# Altium schematic sheet DDR.SchDoc: XC7A3G-LDDR3
size A4; Date: 9 AUG 2026; Engineer: Parsa Malekpour; Revision: 1.0.0; SheetNumber: 10; SheetTotal: 18
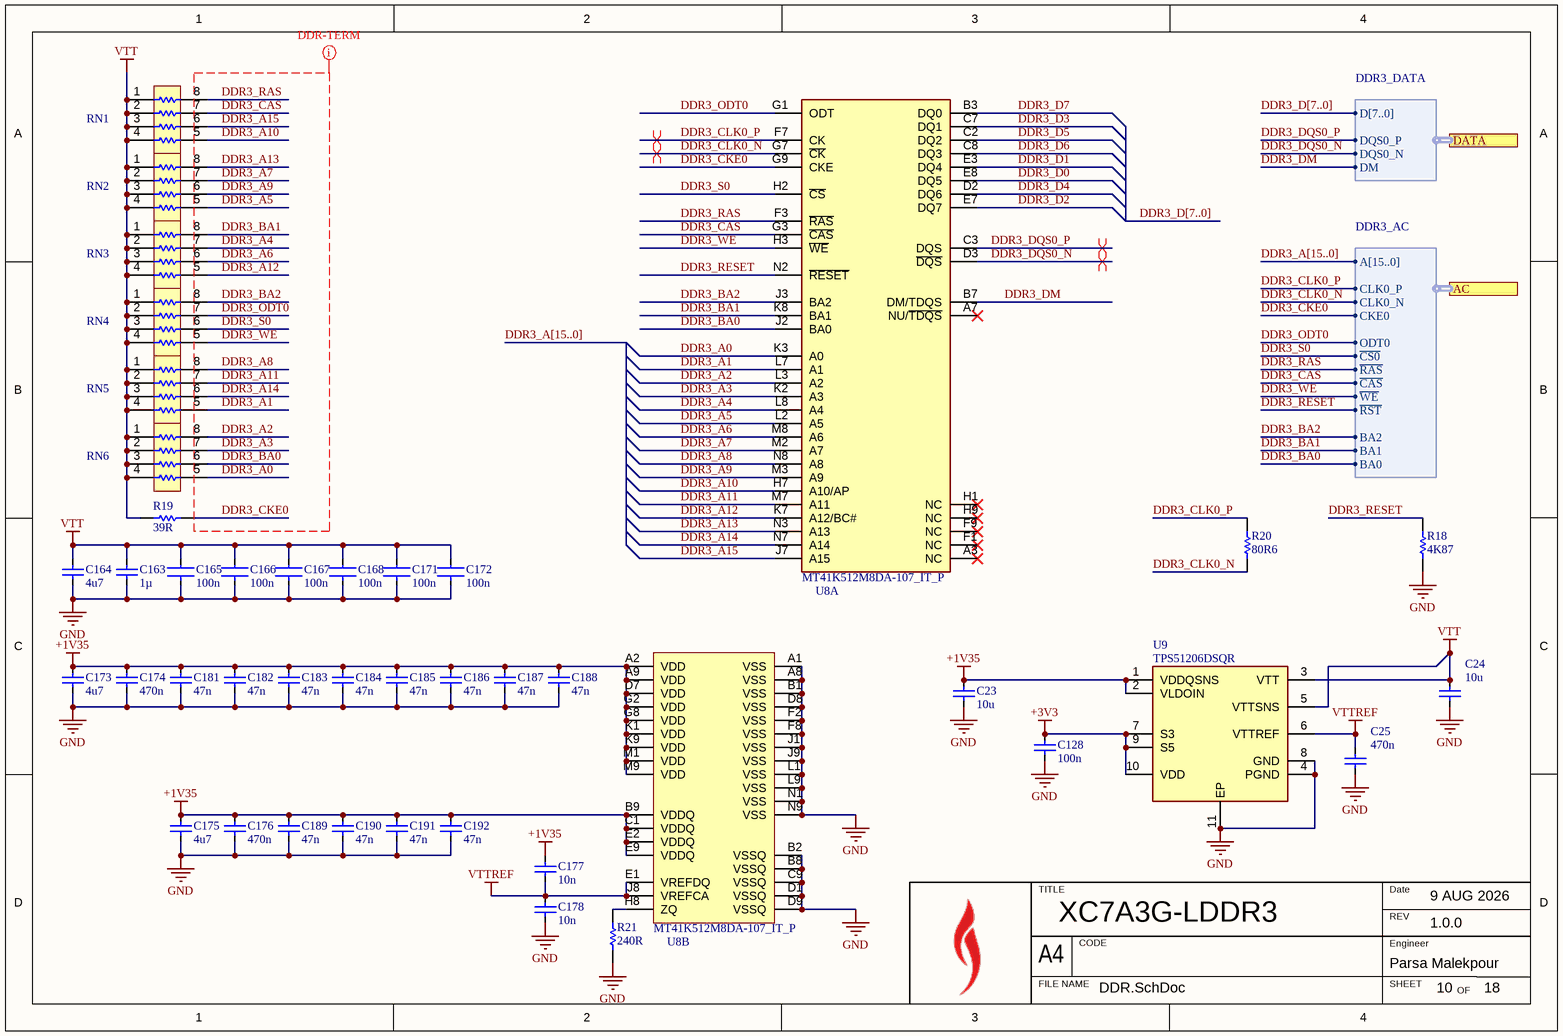
[diagram p0: DDR.SchDoc]

## Parts
C23  value 10u  [FP-C1608-080-0_1-IPC_C]  (hidden comment: C1608JB0J106K080AB)
C24  value 10u  [FP-C1608-080-0_1-IPC_C]  (hidden comment: C1608JB0J106K080AB)
C25  value 470n  [FP-C1005-050-0_05-IPC_C]  (hidden comment: C1005X5R1E474K050BB)
C128  value 100n  [FP-C1005-050-0_05-IPC_C]  (hidden comment: C1005X7R1H104K050BB)
C163  value 1µ  [CAPC1005X55X10NL05]  (hidden comment: C1005X5R1A105K050BB)
C164  value 4u7  [FP-C1005-050-0_20-0_10-IPC_C]  (hidden comment: C1005X5R1A475K050BE)
C165  value 100n  [FP-C1005-050-0_05-IPC_C]  (hidden comment: C1005X7R1H104K050BB)
C166  value 100n  [FP-C1005-050-0_05-IPC_C]  (hidden comment: C1005X7R1H104K050BB)
C167  value 100n  [FP-C1005-050-0_05-IPC_C]  (hidden comment: C1005X7R1H104K050BB)
C168  value 100n  [FP-C1005-050-0_05-IPC_C]  (hidden comment: C1005X7R1H104K050BB)
C171  value 100n  [FP-C1005-050-0_05-IPC_C]  (hidden comment: C1005X7R1H104K050BB)
C172  value 100n  [FP-C1005-050-0_05-IPC_C]  (hidden comment: C1005X7R1H104K050BB)
C173  value 4u7  [FP-C1005-050-0_20-0_10-IPC_C]  (hidden comment: C1005X5R1A475K050BE)
C174  value 470n  [FP-C1005-050-0_05-IPC_C]  (hidden comment: C1005X5R1E474K050BB)
C175  value 4u7  [FP-C1005-050-0_20-0_10-IPC_C]  (hidden comment: C1005X5R1A475K050BE)
C176  value 470n  [FP-C1005-050-0_05-IPC_C]  (hidden comment: C1005X5R1E474K050BB)
C177  value 10n  [FP-C1005-050-0_05-IPC_C]  (hidden comment: C1005X7S2A103K050BB)
C178  value 10n  [FP-C1005-050-0_05-IPC_C]  (hidden comment: C1005X7S2A103K050BB)
C181  value 47n  [FP-C1005-050-0_05-IPC_C]  (hidden comment: C1005X7R1H473K050BB)
C182  value 47n  [FP-C1005-050-0_05-IPC_C]  (hidden comment: C1005X7R1H473K050BB)
C183  value 47n  [FP-C1005-050-0_05-IPC_C]  (hidden comment: C1005X7R1H473K050BB)
C184  value 47n  [FP-C1005-050-0_05-IPC_C]  (hidden comment: C1005X7R1H473K050BB)
C185  value 47n  [FP-C1005-050-0_05-IPC_C]  (hidden comment: C1005X7R1H473K050BB)
C186  value 47n  [FP-C1005-050-0_05-IPC_C]  (hidden comment: C1005X7R1H473K050BB)
C187  value 47n  [FP-C1005-050-0_05-IPC_C]  (hidden comment: C1005X7R1H473K050BB)
C188  value 47n  [FP-C1005-050-0_05-IPC_C]  (hidden comment: C1005X7R1H473K050BB)
C189  value 47n  [FP-C1005-050-0_05-IPC_C]  (hidden comment: C1005X7R1H473K050BB)
C190  value 47n  [FP-C1005-050-0_05-IPC_C]  (hidden comment: C1005X7R1H473K050BB)
C191  value 47n  [FP-C1005-050-0_05-IPC_C]  (hidden comment: C1005X7R1H473K050BB)
C192  value 47n  [FP-C1005-050-0_05-IPC_C]  (hidden comment: C1005X7R1H473K050BB)
R18  value 4K87  [RESC1005X40X25LL05T10]  (hidden comment: RC0402FR-074K87L)
R19  value 39R  [RESC1005X40X25LL05T10]  (hidden comment: RC0402FR-0739RL)
R20  value 80R6  [RESC1005X40X25LL05T10]  (hidden comment: RC0402FR-0780R6L)
R21  value 240R  [RESC1005X40X25LL05T10]  (hidden comment: RC0402FR-07240RL)
RN1  (no value)  [TC124FR0739RL]
RN2  (no value)  [TC124FR0739RL]
RN3  (no value)  [TC124FR0739RL]
RN4  (no value)  [TC124FR0739RL]
RN5  (no value)  [TC124FR0739RL]
RN6  (no value)  [TC124FR0739RL]
U8  MT41K512M8DA-107_IT_P  [BGA78C80P9X13_800X1050X120]  (parts A,B of 2)
U9  TPS51206DSQR  [SON40P200X200X80-11N]

## Ports
AC (harness DDR3_AC, see TOP[3C], BANK35[1B]), DATA (harness DDR3_DATA, see TOP[3C], BANK35[1C])

## Harnesses
DDR3_DATA: D[7..0], DQS0_P, DM, DQS0_N
DDR3_AC: A[15..0], CLK0_P, CKE0, CLK0_N, ODT0, ~{CS0}, ~{RAS}, ~{WE}, ~{CAS}, ~{RST}, BA2, BA1, BA0

## Nets
+1V35: C23.1 C173.1 C174.1 C175.1 C176.1 C177.1 C181.1 C182.1 C183.1 C184.1 C185.1 C186.1 C187.1 C188.1 C189.1 C190.1 C191.1 C192.1 U8.A2(VDD) U8.A9(VDD) U8.B9(VDDQ) U8.C1(VDDQ) U8.D7(VDD) U8.E2(VDDQ) U8.E9(VDDQ) U8.G2(VDD) U8.G8(VDD) U8.K1(VDD) U8.K9(VDD) U8.M1(VDD) U8.M9(VDD) U9.1(VDDQSNS) U9.2(VLDOIN)
+3V3: C128.1 U9.7(S3) U9.9(S5) U9.10(VDD)
GND: C23.2 C24.1 C25.1 C128.2 C163.2 C164.2 C165.1 C166.1 C167.1 C168.1 C171.1 C172.1 C173.2 C174.2 C175.2 C176.2 C178.2 C181.2 C182.2 C183.2 C184.2 C185.2 C186.2 C187.2 C188.2 C189.2 C190.2 C191.2 C192.2 R18.1 R21.2 U8.A1(VSS) U8.A8(VSS) U8.B1(VSS) U8.B2(VSSQ) U8.B8(VSSQ) U8.C9(VSSQ) U8.D1(VSSQ) U8.D8(VSS) U8.D9(VSSQ) U8.F2(VSS) U8.F8(VSS) U8.J1(VSS) U8.J9(VSS) U8.L1(VSS) U8.L9(VSS) U8.N1(VSS) U8.N9(VSS) U9.4(PGND) U9.8(GND) U9.11(EP)
VTT: C24.2 C163.1 C164.1 C165.2 C166.2 C167.2 C168.2 C171.2 C172.2 R19.1 RN1.1 RN1.2 RN1.3 RN1.4 RN2.1 RN2.2 RN2.3 RN2.4 RN3.1 RN3.2 RN3.3 RN3.4 RN4.1 RN4.2 RN4.3 RN4.4 RN5.1 RN5.2 RN5.3 RN5.4 RN6.1 RN6.2 RN6.3 RN6.4 U9.3(VTT) U9.5(VTTSNS)
VTTREF: C25.2 C177.2 C178.1 U8.E1(VREFDQ) U8.J8(VREFCA) U9.6(VTTREF)
DDR3_A0: RN6.5 U8.K3(A0)
DDR3_A1: RN5.5 U8.L7(A1)
DDR3_A2: RN6.8 U8.L3(A2)
DDR3_A3: RN6.7 U8.K2(A3)
DDR3_A4: RN3.7 U8.L8(A4)
DDR3_A5: RN2.5 U8.L2(A5)
DDR3_A6: RN3.6 U8.M8(A6)
DDR3_A7: RN2.7 U8.M2(A7)
DDR3_A8: RN5.8 U8.N8(A8)
DDR3_A9: RN2.6 U8.M3(A9)
DDR3_A10: RN1.5 U8.H7(A10/AP)
DDR3_A11: RN5.7 U8.M7(A11)
DDR3_A12: RN3.5 U8.K7(A12/BC#)
DDR3_A13: RN2.8 U8.N3(A13)
DDR3_A14: RN5.6 U8.N7(A14)
DDR3_A15: RN1.6 U8.J7(A15)
DDR3_BA0: RN6.6 U8.J2(BA0) ; port AC.BA0
DDR3_BA1: RN3.8 U8.K8(BA1) ; port AC.BA1
DDR3_BA2: RN4.8 U8.J3(BA2) ; port AC.BA2
DDR3_CAS: RN1.7 U8.G3(~{CAS}) ; port AC.~{CAS}
DDR3_CKE0: R19.2 U8.G9(CKE) ; port AC.CKE0
DDR3_CLK0_N: R20.2 U8.G7(~{CK}) ; port AC.CLK0_N
DDR3_CLK0_P: R20.1 U8.F7(CK) ; port AC.CLK0_P
DDR3_D0: U8.E8(DQ5)
DDR3_D1: U8.E3(DQ4)
DDR3_D2: U8.E7(DQ7)
DDR3_D3: U8.C7(DQ1)
DDR3_D4: U8.D2(DQ6)
DDR3_D5: U8.C2(DQ2)
DDR3_D6: U8.C8(DQ3)
DDR3_D7: U8.B3(DQ0)
DDR3_DM: U8.B7(DM/TDQS) ; port DATA.DM
DDR3_DQS0_N: U8.D3(~{DQS}) ; port DATA.DQS0_N
DDR3_DQS0_P: U8.C3(DQS) ; port DATA.DQS0_P
DDR3_ODT0: RN4.7 U8.G1(ODT) ; port AC.ODT0
DDR3_RAS: RN1.8 U8.F3(~{RAS}) ; port AC.~{RAS}
DDR3_RESET: R18.2 U8.N2(~{RESET}) ; port AC.~{RST}
DDR3_S0: RN4.6 U8.H2(~{CS}) ; port AC.~{CS0}
DDR3_WE: RN4.5 U8.H3(~{WE}) ; port AC.~{WE}
NetR21_1: R21.1 U8.H8(ZQ)

Not connected (* = marked no-connect by the designer): U8 A3(NC)* A7(NU/~{TDQS})* F1(NC)* F9(NC)* H1(NC)* H9(NC)*

## Buses and harness runs
bus DDR3_A[15..0]
bus DDR3_D[7..0]

## Layout directives
differential pair: DDR3_CLK0_N, DDR3_CLK0_P, DDR3_DQS0_N, DDR3_DQS0_P
net class DDR-TERM: DDR3_A0, DDR3_A1, DDR3_A2, DDR3_A3, DDR3_A4, DDR3_A5, DDR3_A6, DDR3_A7, DDR3_A8, DDR3_A9, DDR3_A10, DDR3_A11, DDR3_A12, DDR3_A13, DDR3_A14, DDR3_A15, DDR3_BA0, DDR3_BA1, DDR3_BA2, DDR3_CAS, DDR3_CKE0, DDR3_ODT0, DDR3_RAS, DDR3_S0, DDR3_WE

## Notes on the sheet
- TITLE
- REV
- Date
- A4
- FILE NAME
- CODE
- SHEET
- Engineer
- OF

## Library data of the parts
C23 C24 = C1608JB0J106K080AB: MLCC 10μF ±10% 6.3V JB SMD 0603; Dielectric Material: Ceramic; Case Code (Imperial): 0603; Thickness: 0.035inch; Min Operating Temperature: -25°C; Termination: SMD/SMT; Lead Free: Lead Free; Resistor Type: Ceramic; Width: 0.8mm; Voltage Rating (DC): 6.3V; Package Quantity: 4000; Tolerance: 10%; Length: 0.063inch; Series: C; Height: 0.8mm; Max Operating Temperature: 85°C; Mount: Surface Mount; RoHS Compliant: Yes; Voltage Rating: 6.3V; Case Code (Metric): 1608; Case/Package: 0603; Packaging: Tape and Reel
C25 = C1005X5R1E474K050BB: MLCC 470nF ±10% 25V X5R SMD 0402; Dielectric Material: Ceramic; Dissipation Factor: 10%; Case Code (Metric): 1005; RoHS Compliant: Yes; Lead Free: Lead Free; Length: 1mm; Case/Package: 0402; Termination: SMD/SMT; Voltage Rating: 25V; Dielectric: X5R; Depth: 0.5mm; Series: C; Voltage: 25V; Tolerance: 10%; Packaging: Tape and Reel; Resistor Type: Ceramic; Min Operating Temperature: -55°C; Width: 0.02inch; Thickness: 500um; Package Quantity: 10000; Case Code (Imperial): 0402; Construction: Flat; Height: 0.5mm; REACH SVHC: No SVHC; Radiation Hardening: No; Weight: 2.3E-05oz; Mount: Surface Mount; Voltage Rating (DC): 25V; Max Operating Temperature: 85°C; Part Number: C1005X5R1E474K050BB
C128 = C1005X7R1H104K050BB: MLCC 100nF ±10% 50V X7R SMD 0402; Dielectric Material: Ceramic; Voltage: 50V; Min Operating Temperature: -55°C; Depth: 0.5mm; Radiation Hardening: No; RoHS Compliant: Yes; Voltage Rating (DC): 50V; Lead Free: Lead Free; Resistor Type: Ceramic; Height: 0.5mm; Dielectric: X7R; Thickness: 0.022inch; Case/Package: 0402; Case Code (Metric): 1005; Termination: SMD/SMT; Packaging: Tape and Reel; Max Operating Temperature: 125°C; Mount: Surface Mount; Package Quantity: 1; Width: 0.02inch; Weight: 2.3E-05oz; Voltage Rating: 50V; Tolerance: 10%; Construction: Flat; Case Code (Imperial): 0402; Length: 1mm; REACH SVHC: No SVHC; Series: C; Part Number: C1005X7R1H104K050BB
C163 = C1005X5R1A105K050BB: Multilayer Ceramic Chip Capacitor, 1 uF, +/- 10%, 10 V, -55 to 85 degC, 0402 (1005 Metric), RoHS, Tape and Reel; Manufacturer: TDK; PCN Part Number: MLCCPartNumberChange30/Nov/2012; Product Training Modules: CSeriesGeneralApplicationsSEAT,CCV,andTVCLDesignToolsGuidetoReplacinganElectrolyticCapacitorwithanMLCC; Voltage - Rated: 10V; Temperature Coefficient: X5R; Online Catalog: CSeries,GeneralPurpose; Other Names: 445-4114-6; Category: Capacitors; Features: -; Lead Style: -; RoHS Information: RoHSCertificate-MLCC; Manufacturer URL: http://www.tdk.com/; Lead Spacing: -; Thickness (Max): 0.022"(0.55mm); Applications: GeneralPurpose; Tolerance: ±10%; Mounting Technology: SurfaceMount; Mounting Type: SurfaceMount,MLCC; Operating Temperature: -55°C~85°C; Datasheet URL: http://download.siliconexpert.com/pdfs/2015/4/21/15/54/45/779/tdk_/manual/37024850441143360mlcc_commercial_general_en.pdf; Package Reference: 1005; Height - Seated (Max): -; Family: CeramicCapacitors; Datasheet Version: 03/2015; Package Description: 2-Pin Surface Mount Device, Body 1 x 0.5 mm; Packaging: Digi-Reel®; Size / Dimension: 0.039"Lx0.020"W(1.00mmx0.50mm); Standard Package: 1; Package / Case: 0402(1005Metric); Ratings: -; Series: C; Part Number: C1005X5R1A105K050BB
C164 C173 C175 = C1005X5R1A475K050BE: CAP CER 4.7UF 10V X5R 0402; Tolerance: 10%; Max Operating Temperature: 85°C; Case Code (Metric): 1005; Voltage Rating: 10V; Packaging: Tape and Reel; Case/Package: 0402; Features: Soft Termination; Min Operating Temperature: -55°C; Mount: Surface Mount; Case Code (Imperial): 0402; RoHS Compliant: Yes; Part Number: C1005X5R1A475K050BE
C165-C168 C171 C172 = CMP-2000-05393-2: Multilayer Ceramic Capacitors 100nF ±10% 50V X7R SMD 0402; Voltage: 50V; Dielectric Material: Ceramic; Min Operating Temperature: -55°C; Depth: 0.5mm; Radiation Hardening: No; RoHS Compliant: Yes; Voltage Rating (DC): 50V; Lead Free: Lead Free; Resistor Type: Ceramic; Height: 0.5mm; Dielectric: X7R; Thickness: 0.022inch; Case/Package: 0402; Case Code (Metric): 1005; Termination: SMD/SMT; Packaging: Tape and Reel; Max Operating Temperature: 125°C; Mount: Surface Mount; Package Quantity: 1; Width: 0.02inch; Weight: 2.3E-05oz; Voltage Rating: 50V; Tolerance: 10%; Construction: Flat; Case Code (Imperial): 0402; Length: 1mm; REACH SVHC: No SVHC; Series: C; Part Number: C1005X7R1H104K050BB
C174 C176 = C1005X5R1E474K050BB: Multilayer Ceramic Capacitors 470nF ±10% 25V X5R SMD 0402; Dissipation Factor: 10%; Case Code (Metric): 1005; RoHS Compliant: Yes; Lead Free: Lead Free; Length: 1mm; Case/Package: 0402; Termination: SMD/SMT; Dielectric Material: Ceramic; Dielectric: X5R; Depth: 0.5mm; Series: C; Voltage: 25V; Tolerance: 10%; Packaging: Tape and Reel; Resistor Type: Ceramic; Min Operating Temperature: -55°C; Width: 0.02inch; Thickness: 500um; Package Quantity: 10000; Case Code (Imperial): 0402; Construction: Flat; Height: 0.5mm; REACH SVHC: No SVHC; Radiation Hardening: No; Weight: 2.3E-05oz; Mount: Surface Mount; Voltage Rating (DC): 25V; Max Operating Temperature: 85°C; Part Number: C1005X5R1E474K050BB; Voltage Rating: 25V
C177 C178 = C1005X7S2A103K050BB: Multilayer Ceramic Capacitors 10nF ±10% 100V X7S SMD 0402; Dissipation Factor: 5%; Case Code (Imperial): 0402; Packaging: Tape and Reel; Voltage Rating (DC): 100V; Max Operating Temperature: 125°C; Min Operating Temperature: -55°C; Case Code (Metric): 1005; Weight: 2.3E-05oz; Length: 1mm; Width: 0.02inch; Tolerance: 10%; Series: C; Package Quantity: 1; RoHS Compliant: Yes; Voltage: 100V; Resistor Type: Ceramic; Number of Pins: 2; Mount: Surface Mount; Height: 0.5mm; Termination: SMD/SMT; Dielectric: X7S; Dielectric Material: Ceramic; Thickness: 0.022inch; REACH SVHC: No SVHC; Lead Free: Lead Free; Voltage Rating: 100V; Case/Package: 0402; Depth: 0.5mm; Part: *; Part Number: C1005X7S2A103K050BB
C181-C192 = C1005X7R1H473K050BB: Multilayer Ceramic Capacitors 47nF ±10% 50V X7R SMD 0402; Dissipation Factor: 5%; Weight: 2.3E-05oz; Max Operating Temperature: 125°C; Package Quantity: 1; Width: 0.02inch; Min Operating Temperature: -55°C; Length: 1mm; Dielectric: X7R; Voltage Rating: 50V; Number of Pins: 2; Lead Free: Lead Free; Voltage: 50V; Dielectric Material: Ceramic; Height: 0.5mm; Case Code (Metric): 1005; Voltage Rating (DC): 50V; Construction: Flat; Termination: SMD/SMT; Case Code (Imperial): 0402; Depth: 0.5mm; Packaging: Tape and Reel; Mount: Surface Mount; Series: C; RoHS Compliant: Yes; Tolerance: 10%; Case/Package: 0402; Thickness: 0.022inch; Radiation Hardening: No; Resistor Type: Ceramic; REACH SVHC: No SVHC; Part Number: C1005X7R1H473K050BB
R18 = RC0402FR-074K87L: Manufacturer: Yageo / Phycomp; Part Number: RC0402FR-074K87L
R19 = RC0402FR-0739RL: Manufacturer: Yageo / Phycomp; Part Number: RC0402FR-0739RL; Parameter 1: *
R20 = RC0402FR-0780R6L: Manufacturer: Yageo; Part Number: RC0402FR-0780R6L; Parameter 1: *
R21 = RC0402FR-07240RL: 240R 0.063W 1% 0402 (1005 Metric)  SMD; Case-Metric: 1005; Case-EIA: 0402; Power: 0.063 W; Tolerance: 1 %; Technology: SMT; Part Number: RC0402FR-07240RL; Parameter 1: *
RN1-RN6 = TC124-FR-0739RL: Resistor Network; Manufacturer_Name: Yageo Group; Datasheet Link: https://media.digikey.com/pdf/Data%20Sheets/Yageo%20PDFs/YC102-358,TC122-164_Series_DS.pdf; Height: 0.5mm; Part Number: TC124-FR-0739RL; Mouser Part Number: 603-TC124-FR-0739RL; Mouser Price/Stock: https://www.mouser.co.uk/ProductDetail/Yageo/TC124-FR-0739RL?qs=k2KEx2DUIRQSySNVqUaapQ%3D%3D; Arrow Part Number: TC124-FR-0739RL; Arrow Price/Stock: null?region=nac
U8 = MT41K512M8DA-107_IT_P: Integrated Circuit; Manufacturer_Name: Micron; Manufacturer_Part_Number: MT41K512M8DA-107 IT:P; Datasheet Link: https://datasheet.datasheetarchive.com/originals/distributors/DKDS42/DSANUWW0045409.pdf; Height: 1.2mm; Mouser Part Number: 340-265832-TRAY; Mouser Price/Stock: https://www.mouser.co.uk/ProductDetail/Micron/MT41K512M8DA-107-ITP?qs=rrS6PyfT74e6FNRbiIMwlg%3D%3D; Arrow Part Number: MT41K512M8DA-107 IT:P; Arrow Price/Stock: https://www.arrow.com/en/products/mt41k512m8da-107-itp/micron-technology?region=europe
U9 = TPS51206DSQR: Integrated Circuit; Manufacturer_Name: Texas Instruments; Datasheet Link: http://www.ti.com/lit/ds/symlink/tps51206.pdf; Height: 0.8mm; Manufacturer_Part_Number: TPS51206DSQR; Mouser Part Number: 595-TPS51206DSQR; Mouser Price/Stock: https://www.mouser.co.uk/ProductDetail/Texas-Instruments/TPS51206DSQR?qs=%252BG2H6gVb6ixLbD%2FQxTGyiQ%3D%3D; Arrow Part Number: TPS51206DSQR; Arrow Price/Stock: https://www.arrow.com/en/products/tps51206dsqr/texas-instruments?region=nac